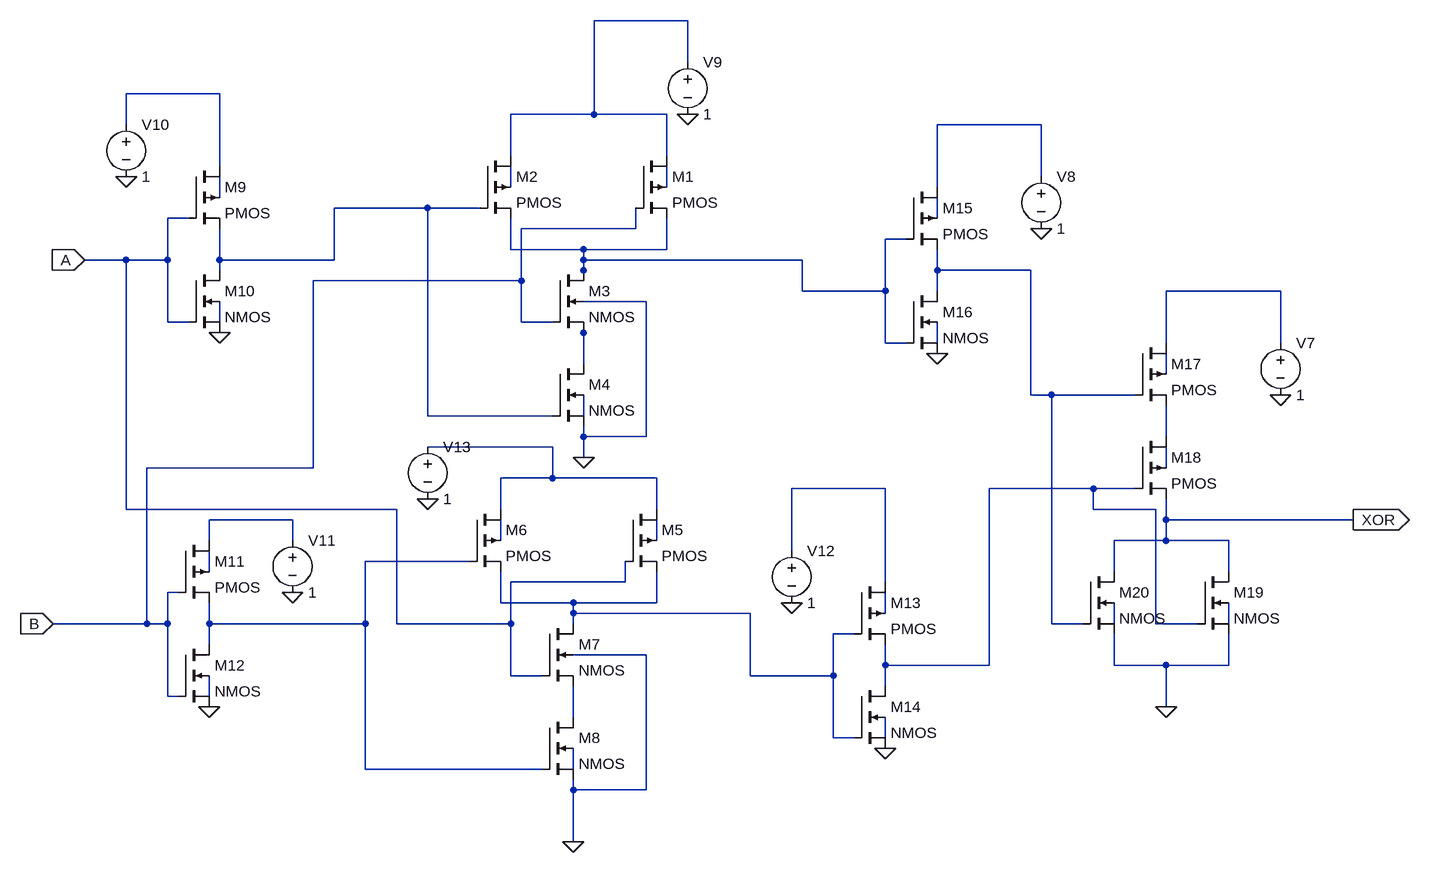
[diagram p0: schematic XOR_Static.asc]
XOR_Static.asc, the LTspice schematic file:
Version 4
SHEET 1 1784 1796
WIRE 320 -320 176 -320
WIRE 320 -256 320 -320
WIRE -400 -208 -544 -208
WIRE 176 -176 176 -320
WIRE 176 -176 48 -176
WIRE 288 -176 176 -176
WIRE -544 -160 -544 -208
WIRE 864 -160 704 -160
WIRE 48 -112 48 -176
WIRE 288 -112 288 -176
WIRE -400 -96 -400 -208
WIRE 864 -80 864 -160
WIRE 48 -64 48 -96
WIRE 288 -64 288 -96
WIRE 704 -64 704 -160
WIRE -400 -48 -400 -80
WIRE -80 -32 -224 -32
WIRE 0 -32 -80 -32
WIRE -448 -16 -480 -16
WIRE 704 -16 704 -48
WIRE 240 0 240 -32
WIRE 240 0 64 0
WIRE 656 16 624 16
WIRE 48 32 48 -16
WIRE 160 32 48 32
WIRE 288 32 288 -16
WIRE 288 32 160 32
WIRE -544 48 -608 48
WIRE -480 48 -480 -16
WIRE -480 48 -544 48
WIRE -400 48 -400 0
WIRE -224 48 -224 -32
WIRE -224 48 -400 48
WIRE 160 48 160 32
WIRE 496 48 160 48
WIRE -400 64 -400 48
WIRE 160 64 160 48
WIRE 704 64 704 32
WIRE 848 64 704 64
WIRE 64 80 64 0
WIRE 64 80 -256 80
WIRE 160 80 160 64
WIRE 496 96 496 48
WIRE 624 96 624 16
WIRE 624 96 496 96
WIRE 704 96 704 64
WIRE 1232 96 1056 96
WIRE 256 112 160 112
WIRE -480 144 -480 48
WIRE -448 144 -480 144
WIRE -400 144 -400 112
WIRE 64 144 64 80
WIRE 112 144 64 144
WIRE 160 160 160 144
WIRE 624 176 624 96
WIRE 656 176 624 176
WIRE 704 176 704 144
WIRE 1056 176 1056 96
WIRE 1232 176 1232 96
WIRE 160 208 160 160
WIRE 1056 224 1056 192
WIRE 848 256 848 64
WIRE 880 256 848 256
WIRE 1008 256 880 256
WIRE -80 288 -80 -32
WIRE 112 288 -80 288
WIRE 160 288 160 256
WIRE 160 320 160 304
WIRE 256 320 256 112
WIRE 256 320 160 320
WIRE 1056 320 1056 272
WIRE 112 336 -80 336
WIRE 160 352 160 320
WIRE -256 368 -256 80
WIRE -256 368 -512 368
WIRE 1056 368 1056 336
WIRE 112 384 112 336
WIRE 112 384 32 384
WIRE 272 384 112 384
WIRE 624 400 480 400
WIRE 944 400 784 400
WIRE 1008 400 944 400
WIRE -544 432 -544 48
WIRE -128 432 -544 432
WIRE 32 432 32 384
WIRE 272 432 272 384
WIRE 944 432 944 400
WIRE 1040 432 944 432
WIRE -288 448 -416 448
WIRE 1056 448 1056 416
WIRE 1344 448 1056 448
WIRE -416 480 -416 448
WIRE -288 480 -288 448
WIRE 32 480 32 448
WIRE 272 480 272 448
WIRE 1056 480 1056 448
WIRE 1056 480 976 480
WIRE 1152 480 1056 480
WIRE 480 496 480 400
WIRE -16 512 -176 512
WIRE -416 528 -416 496
WIRE 976 528 976 480
WIRE 1152 528 1152 480
WIRE 224 544 224 512
WIRE 224 544 48 544
WIRE 624 544 624 400
WIRE -464 560 -480 560
WIRE 32 576 32 528
WIRE 144 576 32 576
WIRE 272 576 272 528
WIRE 272 576 144 576
WIRE 144 592 144 576
WIRE 416 592 144 592
WIRE 624 592 624 560
WIRE -512 608 -512 368
WIRE -512 608 -656 608
WIRE -480 608 -480 560
WIRE -480 608 -512 608
WIRE -416 608 -416 576
WIRE -176 608 -176 512
WIRE -176 608 -416 608
WIRE -128 608 -128 432
WIRE 48 608 48 544
WIRE 48 608 -128 608
WIRE 144 608 144 592
WIRE 880 608 880 256
WIRE 928 608 880 608
WIRE 976 608 976 576
WIRE 1040 608 1040 432
WIRE 1104 608 1040 608
WIRE 1152 608 1152 576
WIRE 576 624 544 624
WIRE -416 640 -416 608
WIRE 256 656 144 656
WIRE 624 672 624 640
WIRE 784 672 784 400
WIRE 784 672 624 672
WIRE 976 672 976 624
WIRE 1056 672 976 672
WIRE 1152 672 1152 624
WIRE 1152 672 1056 672
WIRE 48 688 48 608
WIRE 96 688 48 688
WIRE 416 688 416 592
WIRE 544 688 544 624
WIRE 544 688 416 688
WIRE 624 704 624 672
WIRE -480 720 -480 608
WIRE -464 720 -480 720
WIRE -416 720 -416 688
WIRE 1056 736 1056 672
WIRE 144 752 144 704
WIRE 544 784 544 688
WIRE 576 784 544 784
WIRE 624 784 624 752
WIRE -176 832 -176 608
WIRE 96 832 -176 832
WIRE 144 832 144 800
WIRE 144 864 144 848
WIRE 256 864 256 656
WIRE 256 864 144 864
WIRE 144 944 144 864
FLAG 160 352 0
FLAG 144 944 0
FLAG -416 736 0
FLAG -400 160 0
FLAG 624 800 0
FLAG 704 192 0
FLAG 1056 736 0
FLAG -608 48 A
IOPIN -608 48 In
FLAG -656 608 B
IOPIN -656 608 In
FLAG 1232 256 0
FLAG 864 0 0
FLAG 320 -176 0
FLAG -544 -80 0
FLAG -288 560 0
FLAG 480 576 0
FLAG -80 416 0
FLAG 1344 448 XOR
IOPIN 1344 448 Out
SYMBOL pmos4 240 -112 R0
SYMATTR InstName M1
SYMBOL pmos4 0 -112 R0
SYMATTR InstName M2
SYMBOL nmos4 112 64 R0
SYMATTR InstName M3
SYMBOL nmos4 112 208 R0
SYMATTR InstName M4
SYMBOL pmos4 224 432 R0
SYMATTR InstName M5
SYMBOL pmos4 -16 432 R0
SYMATTR InstName M6
SYMBOL nmos4 96 608 R0
SYMATTR InstName M7
SYMBOL nmos4 96 752 R0
SYMATTR InstName M8
SYMBOL pmos4 -448 -96 R0
SYMATTR InstName M9
SYMBOL nmos4 -448 64 R0
SYMATTR InstName M10
SYMBOL pmos4 -464 480 R0
SYMATTR InstName M11
SYMBOL nmos4 -464 640 R0
SYMATTR InstName M12
SYMBOL pmos4 576 544 R0
SYMATTR InstName M13
SYMBOL nmos4 576 704 R0
SYMATTR InstName M14
SYMBOL pmos4 656 -64 R0
SYMATTR InstName M15
SYMBOL nmos4 656 96 R0
SYMATTR InstName M16
SYMBOL pmos4 1008 176 R0
SYMATTR InstName M17
SYMBOL pmos4 1008 320 R0
SYMATTR InstName M18
SYMBOL nmos4 1104 528 R0
SYMATTR InstName M19
SYMBOL nmos4 928 528 R0
SYMATTR InstName M20
SYMBOL voltage 1232 160 R0
WINDOW 123 0 0 Left 0
WINDOW 39 0 0 Left 0
SYMATTR InstName V7
SYMATTR Value 1
SYMBOL voltage 864 -96 R0
WINDOW 123 0 0 Left 0
WINDOW 39 0 0 Left 0
SYMATTR InstName V8
SYMATTR Value 1
SYMBOL voltage 320 -272 R0
WINDOW 123 0 0 Left 0
WINDOW 39 0 0 Left 0
SYMATTR InstName V9
SYMATTR Value 1
SYMBOL voltage -544 -176 R0
WINDOW 123 0 0 Left 0
WINDOW 39 0 0 Left 0
SYMATTR InstName V10
SYMATTR Value 1
SYMBOL voltage -288 464 R0
WINDOW 123 0 0 Left 0
WINDOW 39 0 0 Left 0
SYMATTR InstName V11
SYMATTR Value 1
SYMBOL voltage 480 480 R0
WINDOW 123 0 0 Left 0
WINDOW 39 0 0 Left 0
SYMATTR InstName V12
SYMATTR Value 1
SYMBOL voltage -80 320 R0
WINDOW 123 0 0 Left 0
WINDOW 39 0 0 Left 0
SYMATTR InstName V13
SYMATTR Value 1

The netlist it stands for:
* XOR_Static.asc
M1 N001 B N009 N005 PMOS
M2 N001 N007 N009 N004 PMOS
M3 N009 B N013 0 NMOS
M4 N013 N007 0 N016 NMOS
M5 N018 A N027 N024 PMOS
M6 N018 N025 N027 N023 PMOS
M7 N027 A N032 0 NMOS
M8 N032 N025 0 N034 NMOS
M9 N002 A N007 N006 PMOS
M10 N007 A 0 N012 NMOS
M11 N022 B N025 N026 PMOS
M12 N025 B 0 N031 NMOS
M13 N020 N027 N021 N028 PMOS
M14 N021 N027 0 N033 NMOS
M15 N003 N009 N010 N008 PMOS
M16 N010 N009 0 N014 NMOS
M17 N011 N010 N017 N015 PMOS
M18 N017 N021 XOR N019 PMOS
M19 XOR N021 0 N030 NMOS
M20 XOR N010 0 N029 NMOS
V7 N011 0 1
V8 N003 0 1
V9 N001 0 1
V10 N002 0 1
V11 N022 0 1
V12 N020 0 1
V13 N018 0 1
.model NMOS NMOS
.model PMOS PMOS
.lib standard.mos
.backanno
.end